# Altium schematic sheet Mainboard_MCU_Func.SchDoc
size A4
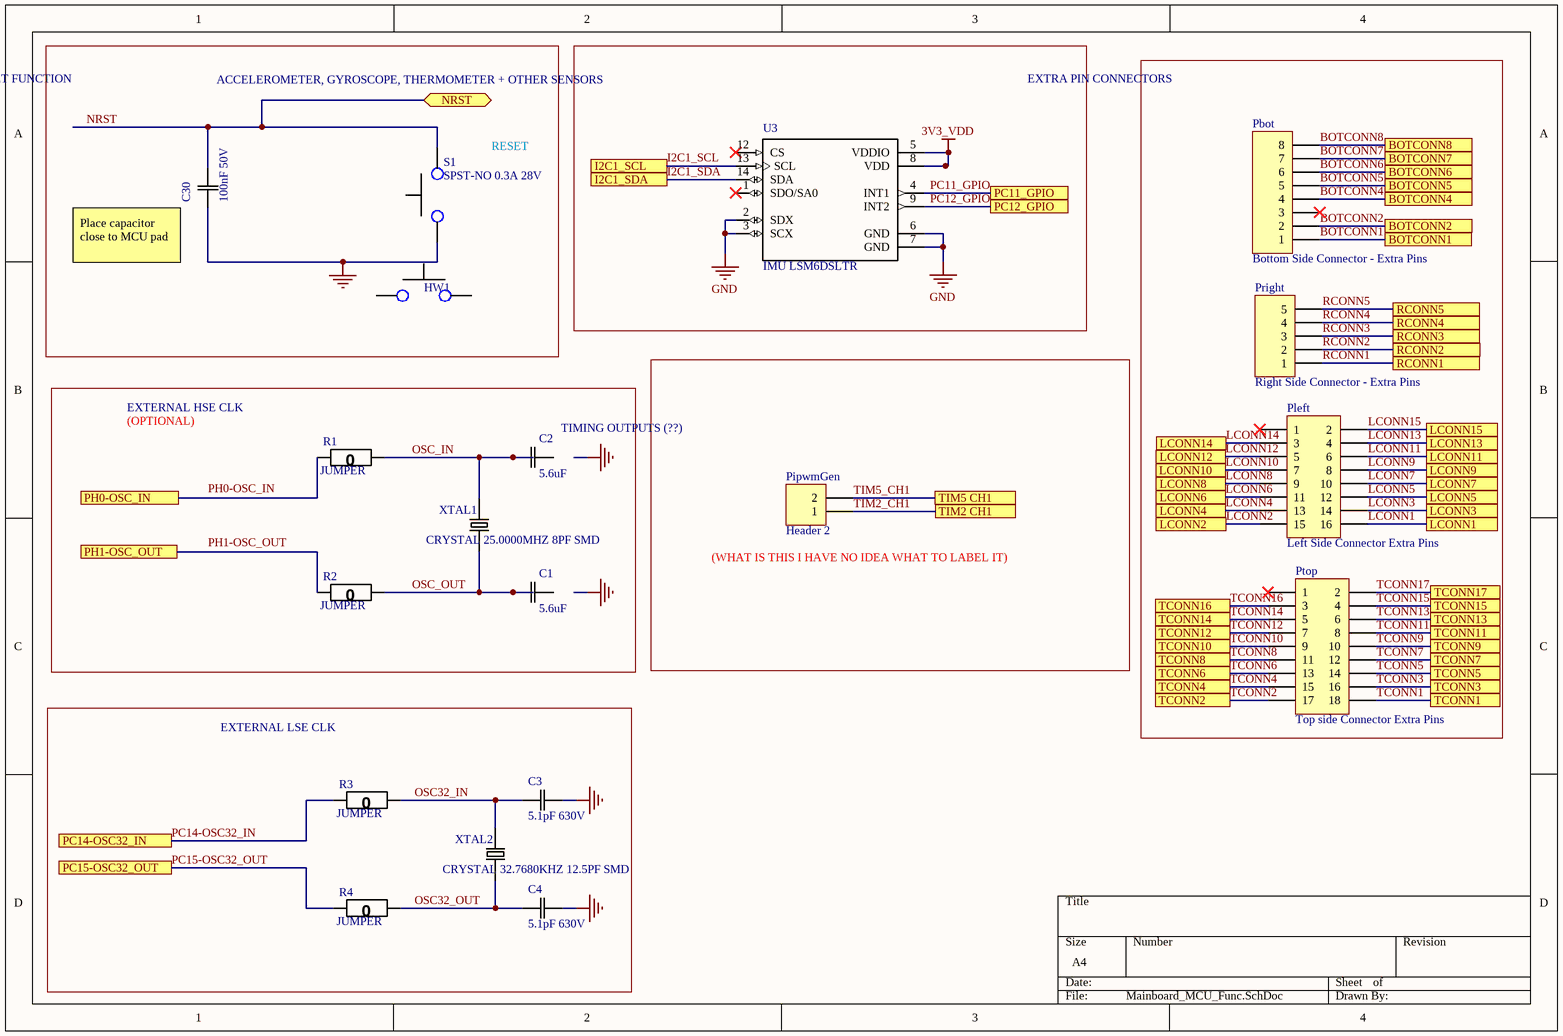
[diagram p0: Mainboard_MCU_Func.SchDoc]

## Parts
C1  5.6uF  [0805]
C2  5.6uF  [0805]
C3  5.1pF 630V  [0805]
C4  5.1pF 630V  [0805]
C30  100nF 50V  [0805]
HW1  SPST-NO 0.3A 28V  [PB300STQ]  (value not drawn)
Pbot  Bottom Side Connector - Extra Pins  [HDR1X8]
PipwmGen  Header 2  [HDR1X2]
Pleft  Left Side Connector Extra Pins  [HDR2X8]
Pright  Right Side Connector - Extra Pins  [HDR1X5]
Ptop  Top side Connector Extra Pins  [HDR2X9]
R1  JUMPER  [0805]
R2  JUMPER  [0805]
R3  JUMPER  [0805]
R4  JUMPER  [0805]
S1  SPST-NO 0.3A 28V  [PB300STQ]
U3  IMU LSM6DSLTR  [LGA-14]
XTAL1  CRYSTAL 25.0000MHZ 8PF SMD  [SMD-2]
XTAL2  CRYSTAL 32.7680KHZ 12.5PF SMD  [SMD-2]

## Blocks framed on the sheet
ACCELEROMETER, GYROSCOPE, THERMOMETER + OTHER SENSORS: U3
EXTRA PIN CONNECTORS: Pbot Pleft Pright Ptop
EXTERNAL LSE CLK: C3 C4 R3 R4 XTAL2

## Ports
BOTCONN1, BOTCONN2, BOTCONN4, BOTCONN5, BOTCONN6, BOTCONN7, BOTCONN8, I2C1_SCL, I2C1_SDA, LCONN1, LCONN2, LCONN3, LCONN4, LCONN5, LCONN6, LCONN7, LCONN8, LCONN9, LCONN10, LCONN11, LCONN12, LCONN13, LCONN14, LCONN15, NRST (bidir), PC11_GPIO, PC12_GPIO, PC14-OSC32_IN, PC15-OSC32_OUT, PH0-OSC_IN, PH1-OSC_OUT, RCONN1, RCONN2, RCONN3, RCONN4, RCONN5, TCONN1, TCONN2, TCONN3, TCONN4, TCONN5, TCONN6, TCONN7, TCONN8, TCONN9, TCONN10, TCONN11, TCONN12, TCONN13, TCONN14, TCONN15, TCONN16, TCONN17, TIM2 CH1, TIM5 CH1

## Nets
3V3_VDD: U3.5(VDDIO) U3.8(VDD)
GND: C3.2(C2) C4.2(C2) C30.1(C1) S1.1 U3.2(SDX) U3.3(SCX) U3.6(GND) U3.7(GND)
BOTCONN1: Pbot.1 ; port BOTCONN1
BOTCONN2: Pbot.2 ; port BOTCONN2
BOTCONN4: Pbot.4 ; port BOTCONN4
BOTCONN5: Pbot.5 ; port BOTCONN5
BOTCONN6: Pbot.6 ; port BOTCONN6
BOTCONN7: Pbot.7 ; port BOTCONN7
BOTCONN8: Pbot.8 ; port BOTCONN8
I2C1_SCL: U3.13(SCL) ; port I2C1_SCL
I2C1_SDA: U3.14(SDA) ; port I2C1_SDA
LCONN1: Pleft.16 ; port LCONN1
LCONN2: Pleft.15 ; port LCONN2
LCONN3: Pleft.14 ; port LCONN3
LCONN4: Pleft.13 ; port LCONN4
LCONN5: Pleft.12 ; port LCONN5
LCONN6: Pleft.11 ; port LCONN6
LCONN7: Pleft.10 ; port LCONN7
LCONN8: Pleft.9 ; port LCONN8
LCONN9: Pleft.8 ; port LCONN9
LCONN10: Pleft.7 ; port LCONN10
LCONN11: Pleft.6 ; port LCONN11
LCONN12: Pleft.5 ; port LCONN12
LCONN13: Pleft.4 ; port LCONN13
LCONN14: Pleft.3 ; port LCONN14
LCONN15: Pleft.2 ; port LCONN15
NRST: C30.2(C2) S1.2 ; port NRST
OSC32_IN: C3.1(C1) R3.1(R1) XTAL2.2
OSC32_OUT: C4.1(C1) R4.1(R1) XTAL2.1
OSC_IN: C2.1(C1) R1.1(R1) XTAL1.2
OSC_OUT: C1.1(C1) R2.1(R1) XTAL1.1
PC11_GPIO: U3.4(INT1) ; port PC11_GPIO
PC12_GPIO: U3.9(INT2) ; port PC12_GPIO
PC14-OSC32_IN: R3.2(R2) ; port PC14-OSC32_IN
PC15-OSC32_OUT: R4.2(R2) ; port PC15-OSC32_OUT
PH0-OSC_IN: R1.2(R2) ; port PH0-OSC_IN
PH1-OSC_OUT: R2.2(R2) ; port PH1-OSC_OUT
RCONN1: Pright.1 ; port RCONN1
RCONN2: Pright.2 ; port RCONN2
RCONN3: Pright.3 ; port RCONN3
RCONN4: Pright.4 ; port RCONN4
RCONN5: Pright.5 ; port RCONN5
TCONN1: Ptop.18 ; port TCONN1
TCONN2: Ptop.17 ; port TCONN2
TCONN3: Ptop.16 ; port TCONN3
TCONN4: Ptop.15 ; port TCONN4
TCONN5: Ptop.14 ; port TCONN5
TCONN6: Ptop.13 ; port TCONN6
TCONN7: Ptop.12 ; port TCONN7
TCONN8: Ptop.11 ; port TCONN8
TCONN9: Ptop.10 ; port TCONN9
TCONN10: Ptop.9 ; port TCONN10
TCONN11: Ptop.8 ; port TCONN11
TCONN12: Ptop.7 ; port TCONN12
TCONN13: Ptop.6 ; port TCONN13
TCONN14: Ptop.5 ; port TCONN14
TCONN15: Ptop.4 ; port TCONN15
TCONN16: Ptop.3 ; port TCONN16
TCONN17: Ptop.2 ; port TCONN17
TIM2_CH1: PipwmGen.1 ; port TIM2 CH1
TIM5_CH1: PipwmGen.2 ; port TIM5 CH1

Not connected (* = marked no-connect by the designer): C1 2(C2); C2 2(C2); HW1 1 2; Pbot 3*; Pleft 1*; Ptop 1*; U3 1(SDO/SA0)* 12(CS)*

## Notes on the sheet
- RESET FUNCTION
- RESET
- (near C30) Place capacitor close to MCU pad
- EXTERNAL HSE CLK
- (OPTIONAL)
- TIMING OUTPUTS (??)
- (near PipwmGen) (WHAT IS THIS I HAVE NO IDEA WHAT TO LABEL IT)
- Labels drawn without touching a wire or pin: PH0-OSC_IN, PH1-OSC_OUT

## Library data of the parts
C1 C2 = CAP 5.6uF 6.3V: CAP CER 5.6UF 6.3V X5R 0805; Tolerance: 10%; Package: 0805; Value: 5.6uF; Rating: 6.3V; Temperature Coefficient: X5R; Operating Temperature: -55°C ~ 85°C
C3 C4 = CAP 5.1pF 630V: CAP CER 5.1PF 630V C0G/NP0 0805; Tolerance: 10%; Rating: 50V; Package: 0805; Value: 5.1pF; Temperature Coefficient: C0G/NP0; Operating Temperature: -55°C ~ 125°C
C30 = CAP 100nF 50V: CAP CER 0.1UF 50V X7R 0805; Tolerance: 10%; Package: 0805; Value: 100nF; Rating: 50V
HW1 S1 = SW PUSH NO: Pushbutton Switch SPST-NO Standard Through Hole; MF: E-Switch; Rating: 28V 0.3A; ComponentLink1Description: Digikey; ComponentLink1URL: https://www.digikey.ca/product-detail/en/e-switch/PB300STQ/EG5398-ND/6126493; ComponentLink2Description: Datasheet; ComponentLink2URL: https://sten-eswitch-13110800-production.s3.amazonaws.com/system/asset/product_line/data_sheet/222/PB300.pdf; Digikey: EG5398-ND; Digikey Link: https://www.digikey.ca/product-detail/en/e-switch/PB300STQ/EG5398-ND/6126493; MP: PB300STQ; Price: 3.40000 CAD
Pbot = Header 8: Header, 8-Pin; LatestRevisionDate: 17-Jul-2002; LatestRevisionNote: Re-released for DXP Platform.; Publisher: Altium Limited
PipwmGen = Header 2: Header, 2-Pin; LatestRevisionDate: 17-Jul-2002; LatestRevisionNote: Re-released for DXP Platform.; Publisher: Altium Limited
Pleft = Header 8X2: Header, 8-Pin, Dual row; LatestRevisionDate: 17-Jul-2002; LatestRevisionNote: Re-released for DXP Platform.; Publisher: Altium Limited
Pright = Header 5: Header, 5-Pin; LatestRevisionDate: 17-Jul-2002; LatestRevisionNote: Re-released for DXP Platform.; Publisher: Altium Limited
Ptop = Header 9X2: Header, 9-Pin, Dual row; LatestRevisionDate: 17-Jul-2002; LatestRevisionNote: Re-released for DXP Platform.; Publisher: Altium Limited
R1-R4 = RES 0 JUMPER: RES SMD 0 OHM JUMPER GENERIC 0805; Value: 0; Package: 0805
U3 = IMU LSM6DSLTR: IMU ACCEL/GYRO I2C/SPI 14LGA; MF: STMicroelectronics; SnapEDA_Link: https://www.snapeda.com/parts/LSM6DSLTR/STMicroelectronics/view-part/550517/?ref=snap; MP: LSM6DSLTR; Package: LGA-14 STMicroelectronics; Digikey: https://www.digikey.ca/product-detail/en/stmicroelectronics/LSM6DSLTR/497-16705-1-ND/6192805; Supplier 1: Digi-Key; Supplier Part Number 1: 497-16705-1-ND
XTAL1 = XTAL 25MHZ 8PF SMD: 25MHz ±50ppm Crystal 8pF 70 Ohms 2-SMD, No Lead; MP: NX5032GA-25.000000MHZ-LN-CD-1; MF: NDK America, Inc.; ESR: 70 Ohms; Package: 2-SMD, No Lead; Price: 0.95 CAD; Frequency: 25MHz; Digikey: 644-1041-1-ND; Digikey Link: https://www.digikey.ca/product-detail/en/ndk-america-inc/NX5032GA-25.000000MHZ-LN-CD-1/644-1041-1-ND/1128913; Load Capacitance: 8pF; Supplier 1: Digi-Key; Supplier Part Number 1: 644-1041-1-ND
XTAL2 = XTAL 32.7680KHZ 12.5PF SMD: 32.768kHz ±20ppm Crystal 12.5pF 70 kOhms 2-SMD, No Lead; MP: NX3215SA-32.768K-STD-MUA-8; MF: NDK America, Inc.; Package: 2-SMD, No Lead; Price: 1.04000 CAD; Frequency: 32.768kHz; Digikey: 644-1156-1-ND; Digikey Link: https://www.digikey.ca/en/products/detail/ndk-america-inc/NX3215SA-32-768K-STD-MUA-8/2261469?s=N4IgTCBcDaIGwBYEFoCMqCsc3IHIBEQBdAXyA; Load Capacitance: 12.5pF; ESR: 70 kOhms; ComponentLink1Description: Digikey; ComponentLink1URL: https://www.digikey.ca/en/products/detail/ndk-america-inc/NX3215SA-32-768K-STD-MUA-8/2261469; ComponentLink2Description: Datasheet; ComponentLink2URL: https://media.digikey.com/datasheets/production/702868/1/NX3215SA-32-768K-STD-MUA-8.html; Supplier 1: Digi-Key; Supplier Part Number 1: 644-1156-1-ND